# Altium schematic sheet IO.SchDoc
size A
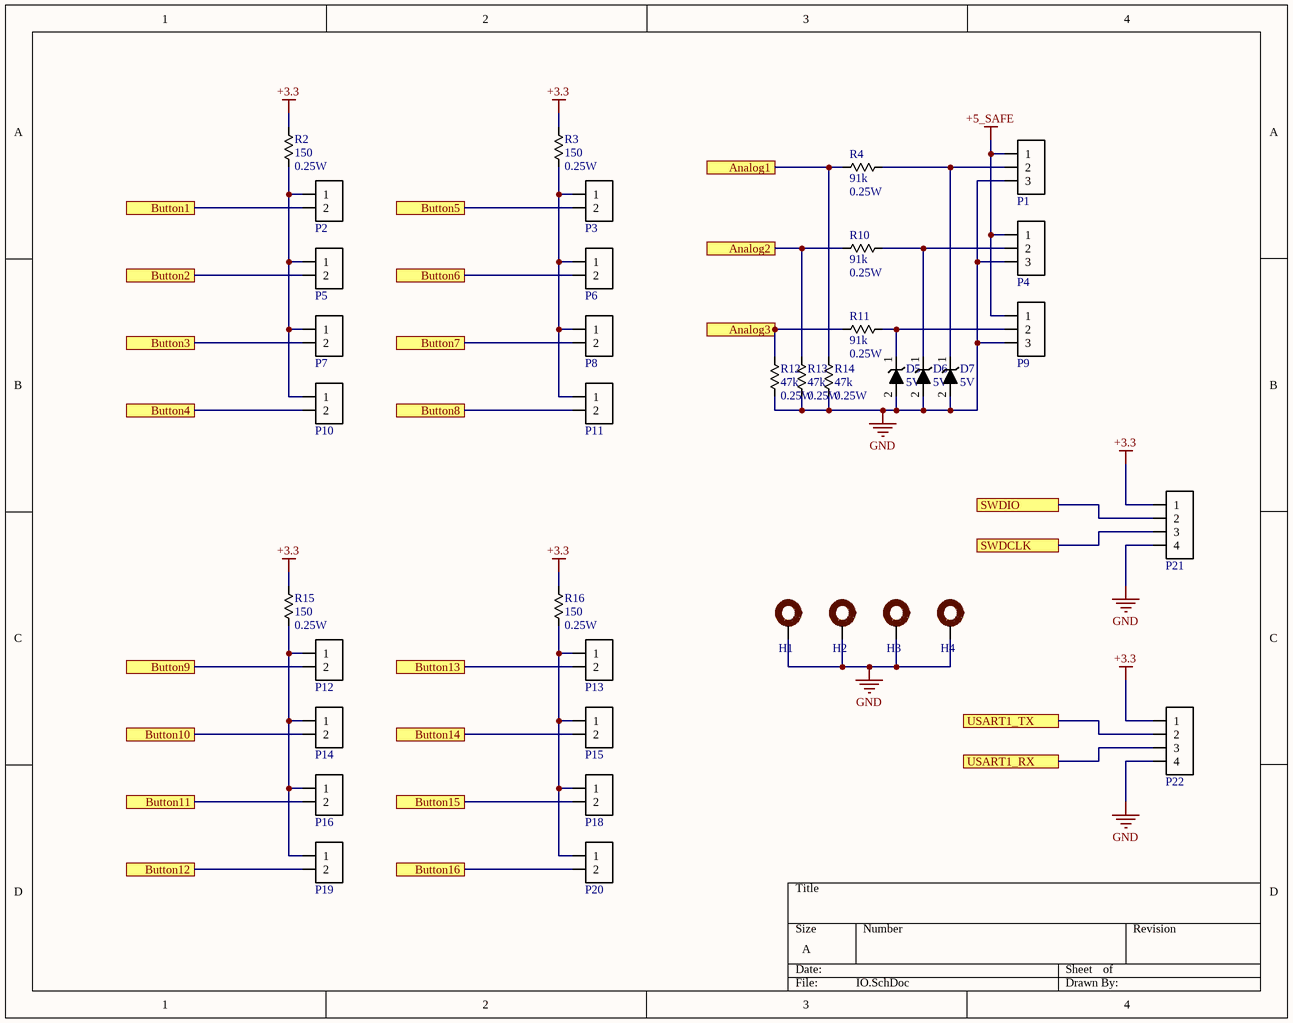
[diagram p0: IO.SchDoc]

## Parts
D5  Reverse Breakdown Voltage: 5V  [sod323_0]  (hidden comment: diode_1)
D6  Reverse Breakdown Voltage: 5V  [sod323_0]  (hidden comment: diode_1)
D7  Reverse Breakdown Voltage: 5V  [sod323_0]  (hidden comment: diode_1)
H1  mounting_hole_0  [#8-32_SOCKET_HEAD]  (value not drawn)
H2  mounting_hole_0  [#8-32_SOCKET_HEAD]  (value not drawn)
H3  mounting_hole_0  [#8-32_SOCKET_HEAD]  (value not drawn)
H4  mounting_hole_0  [#8-32_SOCKET_HEAD]  (value not drawn)
P1  conn-3x1_0  [JST_PHR_3_0]  (value not drawn)
P2  conn-2x1_0  [JST_PHR_2_0]  (value not drawn)
P3  conn-2x1_0  [JST_PHR_2_0]  (value not drawn)
P4  conn-3x1_0  [JST_PHR_3_0]  (value not drawn)
P5  conn-2x1_0  [JST_PHR_2_0]  (value not drawn)
P6  conn-2x1_0  [JST_PHR_2_0]  (value not drawn)
P7  conn-2x1_0  [JST_PHR_2_0]  (value not drawn)
P8  conn-2x1_0  [JST_PHR_2_0]  (value not drawn)
P9  conn-3x1_0  [JST_PHR_3_0]  (value not drawn)
P10  conn-2x1_0  [JST_PHR_2_0]  (value not drawn)
P11  conn-2x1_0  [JST_PHR_2_0]  (value not drawn)
P12  conn-2x1_0  [JST_PHR_2_0]  (value not drawn)
P13  conn-2x1_0  [JST_PHR_2_0]  (value not drawn)
P14  conn-2x1_0  [JST_PHR_2_0]  (value not drawn)
P15  conn-2x1_0  [JST_PHR_2_0]  (value not drawn)
P16  conn-2x1_0  [JST_PHR_2_0]  (value not drawn)
P18  conn-2x1_0  [JST_PHR_2_0]  (value not drawn)
P19  conn-2x1_0  [JST_PHR_2_0]  (value not drawn)
P20  conn-2x1_0  [JST_PHR_2_0]  (value not drawn)
P21  conn-4x1_0  [HDDR_4x1_0]  (value not drawn)
P22  conn-4x1_0  [HDDR_4x1_0]  (value not drawn)
R2  Resistance: 150  Power Rating: 0.25W  [chip_0603]  (hidden comment: res_single)
R3  Resistance: 150  Power Rating: 0.25W  [chip_0603]  (hidden comment: res_single)
R4  Resistance: 91k  Power Rating: 0.25W  [chip_0603]  (hidden comment: res_single)
R10  Resistance: 91k  Power Rating: 0.25W  [chip_0603]  (hidden comment: res_single)
R11  Resistance: 91k  Power Rating: 0.25W  [chip_0603]  (hidden comment: res_single)
R12  Resistance: 47k  Power Rating: 0.25W  [chip_0603]  (hidden comment: res_single)
R13  Resistance: 47k  Power Rating: 0.25W  [chip_0603]  (hidden comment: res_single)
R14  Resistance: 47k  Power Rating: 0.25W  [chip_0603]  (hidden comment: res_single)
R15  Resistance: 150  Power Rating: 0.25W  [chip_0603]  (hidden comment: res_single)
R16  Resistance: 150  Power Rating: 0.25W  [chip_0603]  (hidden comment: res_single)

## Ports
Analog1, Analog2, Analog3, Button1, Button2, Button3, Button4, Button5, Button6, Button7, Button8, Button9, Button10, Button11, Button12, Button13, Button14, Button15, Button16, SWDCLK, SWDIO, USART1_RX, USART1_TX

## Nets
+3.3: P21.1 P22.1 R2.2 R3.2 R15.2 R16.2
+5_SAFE: P1.1 P4.1 P9.1
GND: D5.2 D6.2 D7.2 H1.0(A) H2.0(A) H3.0(A) H4.0(A) P1.3 P4.3 P9.3 P21.4 P22.4 R12.2 R13.2 R14.2
Analog1: R4.1 R14.1 ; port Analog1
Analog2: R10.1 R13.1 ; port Analog2
Analog3: R11.1 R12.1 ; port Analog3
Button1: P2.2 ; port Button1
Button2: P5.2 ; port Button2
Button3: P7.2 ; port Button3
Button4: P10.2 ; port Button4
Button5: P3.2 ; port Button5
Button6: P6.2 ; port Button6
Button7: P8.2 ; port Button7
Button8: P11.2 ; port Button8
Button9: P12.2 ; port Button9
Button10: P14.2 ; port Button10
Button11: P16.2 ; port Button11
Button12: P19.2 ; port Button12
Button13: P13.2 ; port Button13
Button14: P15.2 ; port Button14
Button15: P18.2 ; port Button15
Button16: P20.2 ; port Button16
SWDCLK: P21.3 ; port SWDCLK
SWDIO: P21.2 ; port SWDIO
USART1_RX: P22.3 ; port USART1_RX
USART1_TX: P22.2 ; port USART1_TX
NetD5_1: D5.1 P9.2 R11.2
NetD6_1: D6.1 P4.2 R10.2
NetD7_1: D7.1 P1.2 R4.2
NetP2_1: P2.1 P5.1 P7.1 P10.1 R2.1
NetP3_1: P3.1 P6.1 P8.1 P11.1 R3.1
NetP12_1: P12.1 P14.1 P16.1 P19.1 R15.1
NetP13_1: P13.1 P15.1 P18.1 P20.1 R16.1

## Library data of the parts
D5-D7 = DIO-00037: TVS, 5V, 500W, SOD-323; Manufacturer: ST; Manufacturer PN: ESDA8V2-1J; Type: TVS; Part Number: DIO-00037; Power Rating: 500W; Cost: 0.33
H1-H4 = MISC-00027: #8-32 Mounting Hole for Socket Head Cap Screw; Part Number: MISC-00027
P1 P4 P9 = CONN-00047: JST PH 3x1, THT, 2.00mm Pitch; Manufacturer PN: B3B-PH-K; Positions per level: 3; Levels: 1; Part Number: CONN-00047; Type: Header; Manufacturer: JST; Cost: 0.19
P2 P3 P5-P8 P10-P16 P18-P20 = CONN-00048: JST PH 2x1, THT, 2.00mm Pitch; Manufacturer PN: B2B-PH-K; Positions per level: 2; Levels: 1; Part Number: CONN-00048; Type: Header; Manufacturer: JST; Cost: 0.19
P21 P22 = CONN-00029: Header 4x1, 0.1"; Positions per level: 4; Levels: 1; Part Number: CONN-00029; Type: Header
R2 R3 R15 R16 = RES-00188: RES SMD 150 OHM 1% 1/4W 0603; Manufacturer: Panasonic; Manufacturer PN: ERJ-PA3F1500V; Tolerance: 1%; Part Number: RES-00188
R4 R10 R11 = RES-00586: RES SMD 91K OHM 1% 1/4W 0603; Manufacturer: Panasonic; Manufacturer PN: ERJ-PA3F9102V; Tolerance: 1%; Part Number: RES-00586
R12-R14 = RES-00492: RES SMD 47K OHM 1% 1/4W 0603; Manufacturer: Panasonic; Manufacturer PN: ERJ-PA3F4702V; Tolerance: 1%; Part Number: RES-00492